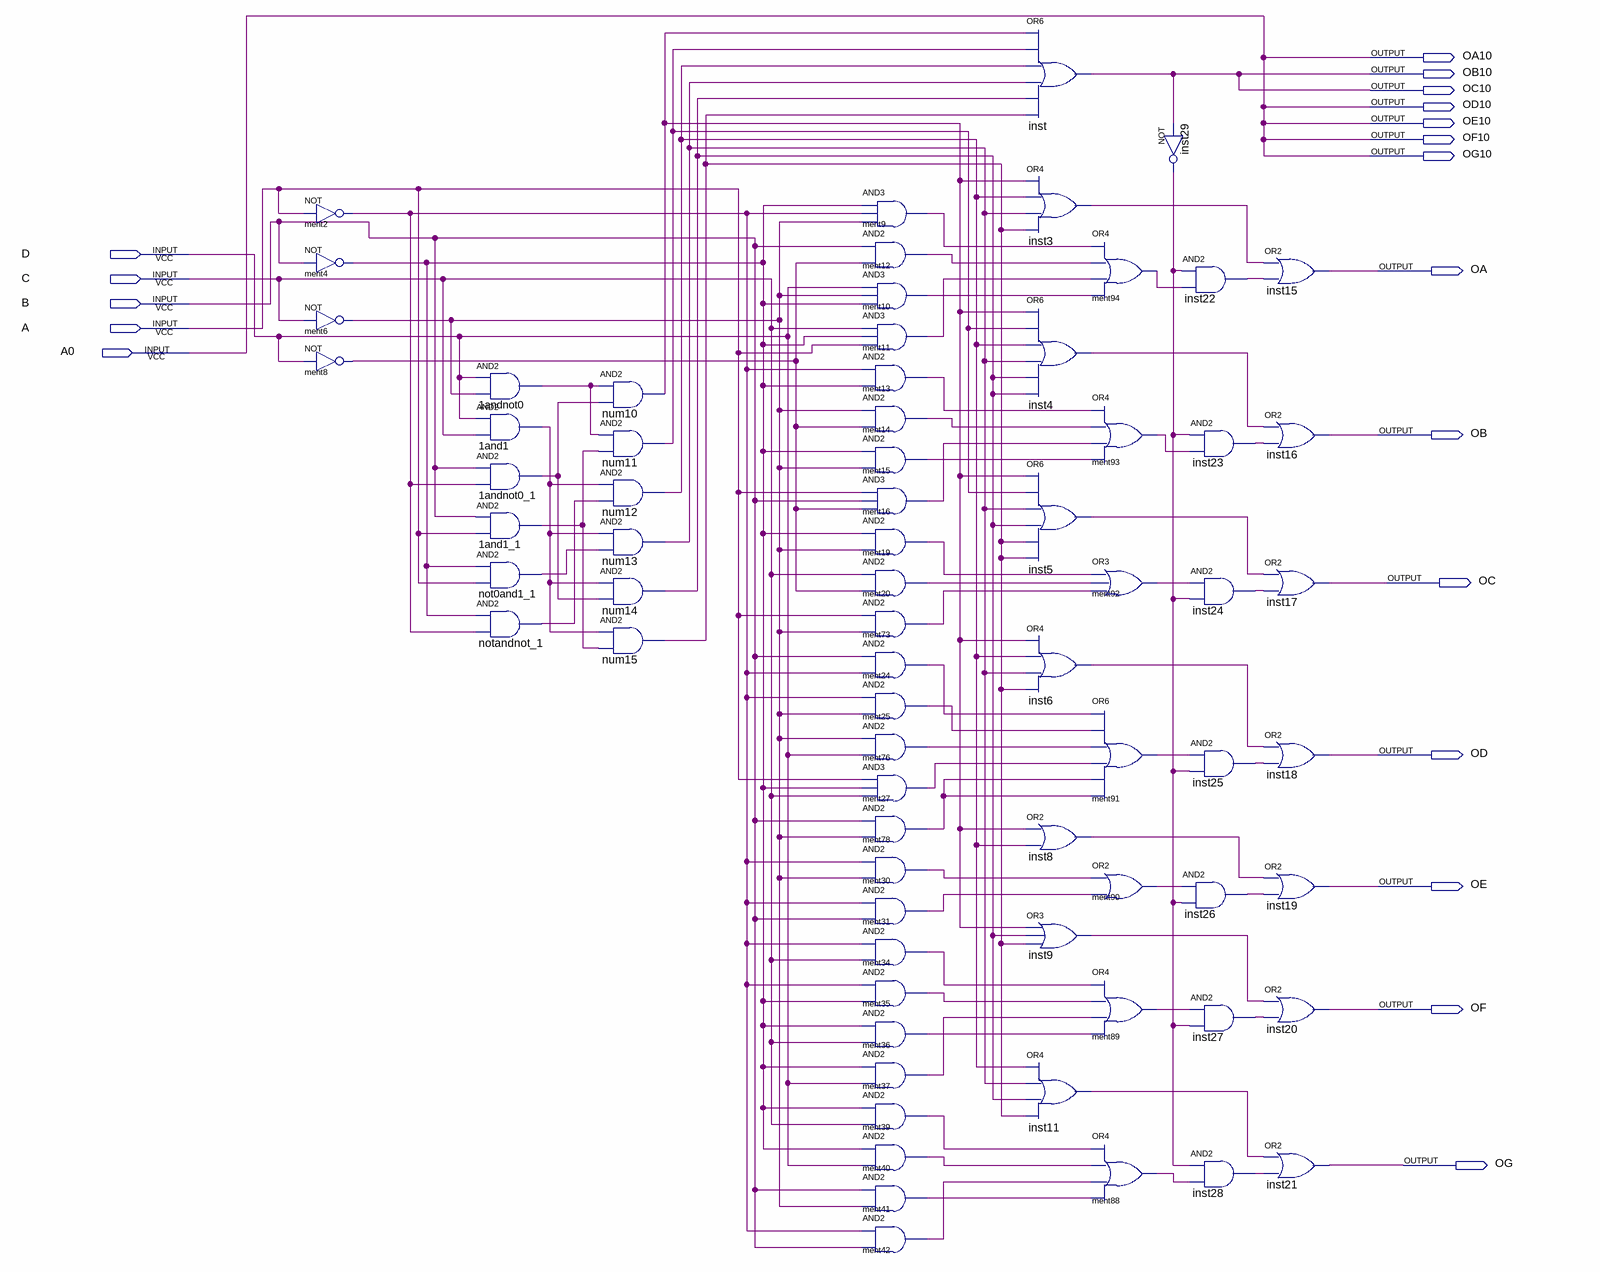
[diagram p0: schematic sheet]
// Quartus schematic 15digit_final.bdf as structural Verilog: 72 symbols, 19 pins
module \15digit_final  (
  input  D,
  input  C,
  input  B,
  input  A,
  input  A0,
  output OA10,
  output OB10,
  output OC10,
  output OD10,
  output OE10,
  output OF10,
  output OG10,
  output OA,
  output OB,
  output OC,
  output OD,
  output OE,
  output OF,
  output OG
);

  wire inst3_out, inst4_out, inst5_out, inst6_out, inst8_out, inst9_out, inst11_out, inst22_out, inst23_out,
       inst24_out, inst25_out, inst26_out, inst27_out, inst28_out, inst29_out, ment2_out, ment4_out,
       ment6_out, ment8_out, ment9_out, ment10_out, ment11_out, ment12_out, ment13_out, ment14_out,
       ment15_out, ment16_out, ment19_out, ment20_out, ment24_out, ment25_out, ment27_out, ment30_out,
       ment31_out, ment34_out, ment35_out, ment36_out, ment37_out, ment39_out, ment40_out, ment41_out,
       ment42_out, ment73_out, ment76_out, ment78_out, ment88_out, ment89_out, ment90_out, ment91_out,
       ment92_out, ment93_out, ment94_out, n1and1_1_out, n1and1_out, n1andnot0_1_out, n1andnot0_out,
       not0and1_1_out, notandnot_1_out, num10_out, num11_out, num12_out, num13_out, num14_out, num15_out;

  not ment2 (ment2_out, A);
  not ment4 (ment4_out, B);
  not ment6 (ment6_out, C);
  not ment8 (ment8_out, D);
  and u_1andnot0 (n1andnot0_out, D, ment6_out);
  and u_1and1 (n1and1_out, D, C);
  and u_1andnot0_1 (n1andnot0_1_out, B, ment2_out);
  and u_1and1_1 (n1and1_1_out, B, A);
  and not0and1_1 (not0and1_1_out, ment4_out, A);
  and notandnot_1 (notandnot_1_out, ment4_out, ment2_out);
  and num10 (num10_out, n1andnot0_out, n1andnot0_1_out);
  and num11 (num11_out, n1andnot0_out, n1and1_1_out);
  and num12 (num12_out, n1and1_out, notandnot_1_out);
  and num13 (num13_out, n1and1_out, not0and1_1_out);
  and num14 (num14_out, n1and1_out, n1andnot0_1_out);
  and num15 (num15_out, n1and1_out, n1and1_1_out);
  and ment9 (ment9_out, ment4_out, ment2_out, ment6_out);
  and ment12 (ment12_out, B, ment8_out);
  and ment10 (ment10_out, D, ment6_out, ment4_out);
  and ment11 (ment11_out, C, ment4_out, A);
  and ment13 (ment13_out, ment2_out, ment4_out);
  and ment14 (ment14_out, ment6_out, ment8_out);
  and ment15 (ment15_out, ment4_out, ment6_out);
  and ment16 (ment16_out, A, B, ment8_out);
  and ment19 (ment19_out, ment4_out, ment6_out);
  and ment20 (ment20_out, C, ment8_out);
  and ment73 (ment73_out, A, ment6_out);
  and ment24 (ment24_out, B, ment2_out);
  and ment25 (ment25_out, ment2_out, ment6_out);
  and ment76 (ment76_out, ment6_out, D);
  and ment27 (ment27_out, A, ment4_out, C);
  and ment78 (ment78_out, B, ment6_out);
  and ment30 (ment30_out, ment2_out, ment6_out);
  and ment31 (ment31_out, ment2_out, B);
  and ment34 (ment34_out, ment2_out, C);
  and ment35 (ment35_out, ment2_out, ment4_out);
  and ment36 (ment36_out, ment4_out, C);
  and ment37 (ment37_out, ment4_out, D);
  and ment39 (ment39_out, ment4_out, C);
  and ment40 (ment40_out, ment4_out, D);
  and ment41 (ment41_out, B, ment6_out);
  and ment42 (ment42_out, ment2_out, B);
  or inst (OB10, num10_out, num11_out, num12_out, num13_out, num14_out, num15_out);
  or inst3 (inst3_out, num10_out, num12_out, num13_out, num15_out);
  or inst4 (inst4_out, num10_out, num11_out, num12_out, num13_out, num14_out, num14_out);
  or inst5 (inst5_out, num10_out, num11_out, num13_out, num14_out, num15_out, num15_out);
  or inst6 (inst6_out, num10_out, num12_out, num13_out, num15_out);
  or inst8 (inst8_out, num10_out, num12_out);
  or inst9 (inst9_out, num10_out, num14_out, num15_out);
  or inst11 (inst11_out, num12_out, num13_out, num14_out, num15_out);
  or ment94 (ment94_out, ment9_out, ment12_out, ment11_out, ment10_out);
  or ment93 (ment93_out, ment13_out, ment14_out, ment16_out, ment15_out);
  or ment92 (ment92_out, ment19_out, ment20_out, ment73_out);
  or ment91 (ment91_out, ment24_out, ment25_out, ment76_out, ment27_out, ment78_out, ment78_out);
  or ment90 (ment90_out, ment30_out, ment31_out);
  or ment89 (ment89_out, ment34_out, ment35_out, ment37_out, ment36_out);
  or ment88 (ment88_out, ment39_out, ment40_out, ment42_out, ment41_out);
  not inst29 (inst29_out, OB10);
  and inst22 (inst22_out, inst29_out, ment94_out);
  and inst23 (inst23_out, inst29_out, ment93_out);
  and inst24 (inst24_out, ment92_out, inst29_out);
  and inst25 (inst25_out, ment91_out, inst29_out);
  and inst26 (inst26_out, ment90_out, inst29_out);
  and inst27 (inst27_out, ment89_out, inst29_out);
  and inst28 (inst28_out, inst29_out, ment88_out);
  or inst15 (OA, inst3_out, inst22_out);
  or inst16 (OB, inst4_out, inst23_out);
  or inst17 (OC, inst5_out, inst24_out);
  or inst18 (OD, inst6_out, inst25_out);
  or inst19 (OE, inst8_out, inst26_out);
  or inst20 (OF, inst9_out, inst27_out);
  or inst21 (OG, inst11_out, inst28_out);

  assign OA10 = A0;
  assign OC10 = OB10;
  assign OD10 = A0;
  assign OE10 = A0;
  assign OF10 = A0;
  assign OG10 = A0;
endmodule
